# EAGLE design Avionics868 (EAGLE 7.6.0)
COMPANY: ADAFRUIT INDUSTRIES; DRAWN: KTOWN; REV: B

## Sheet 1 of 2
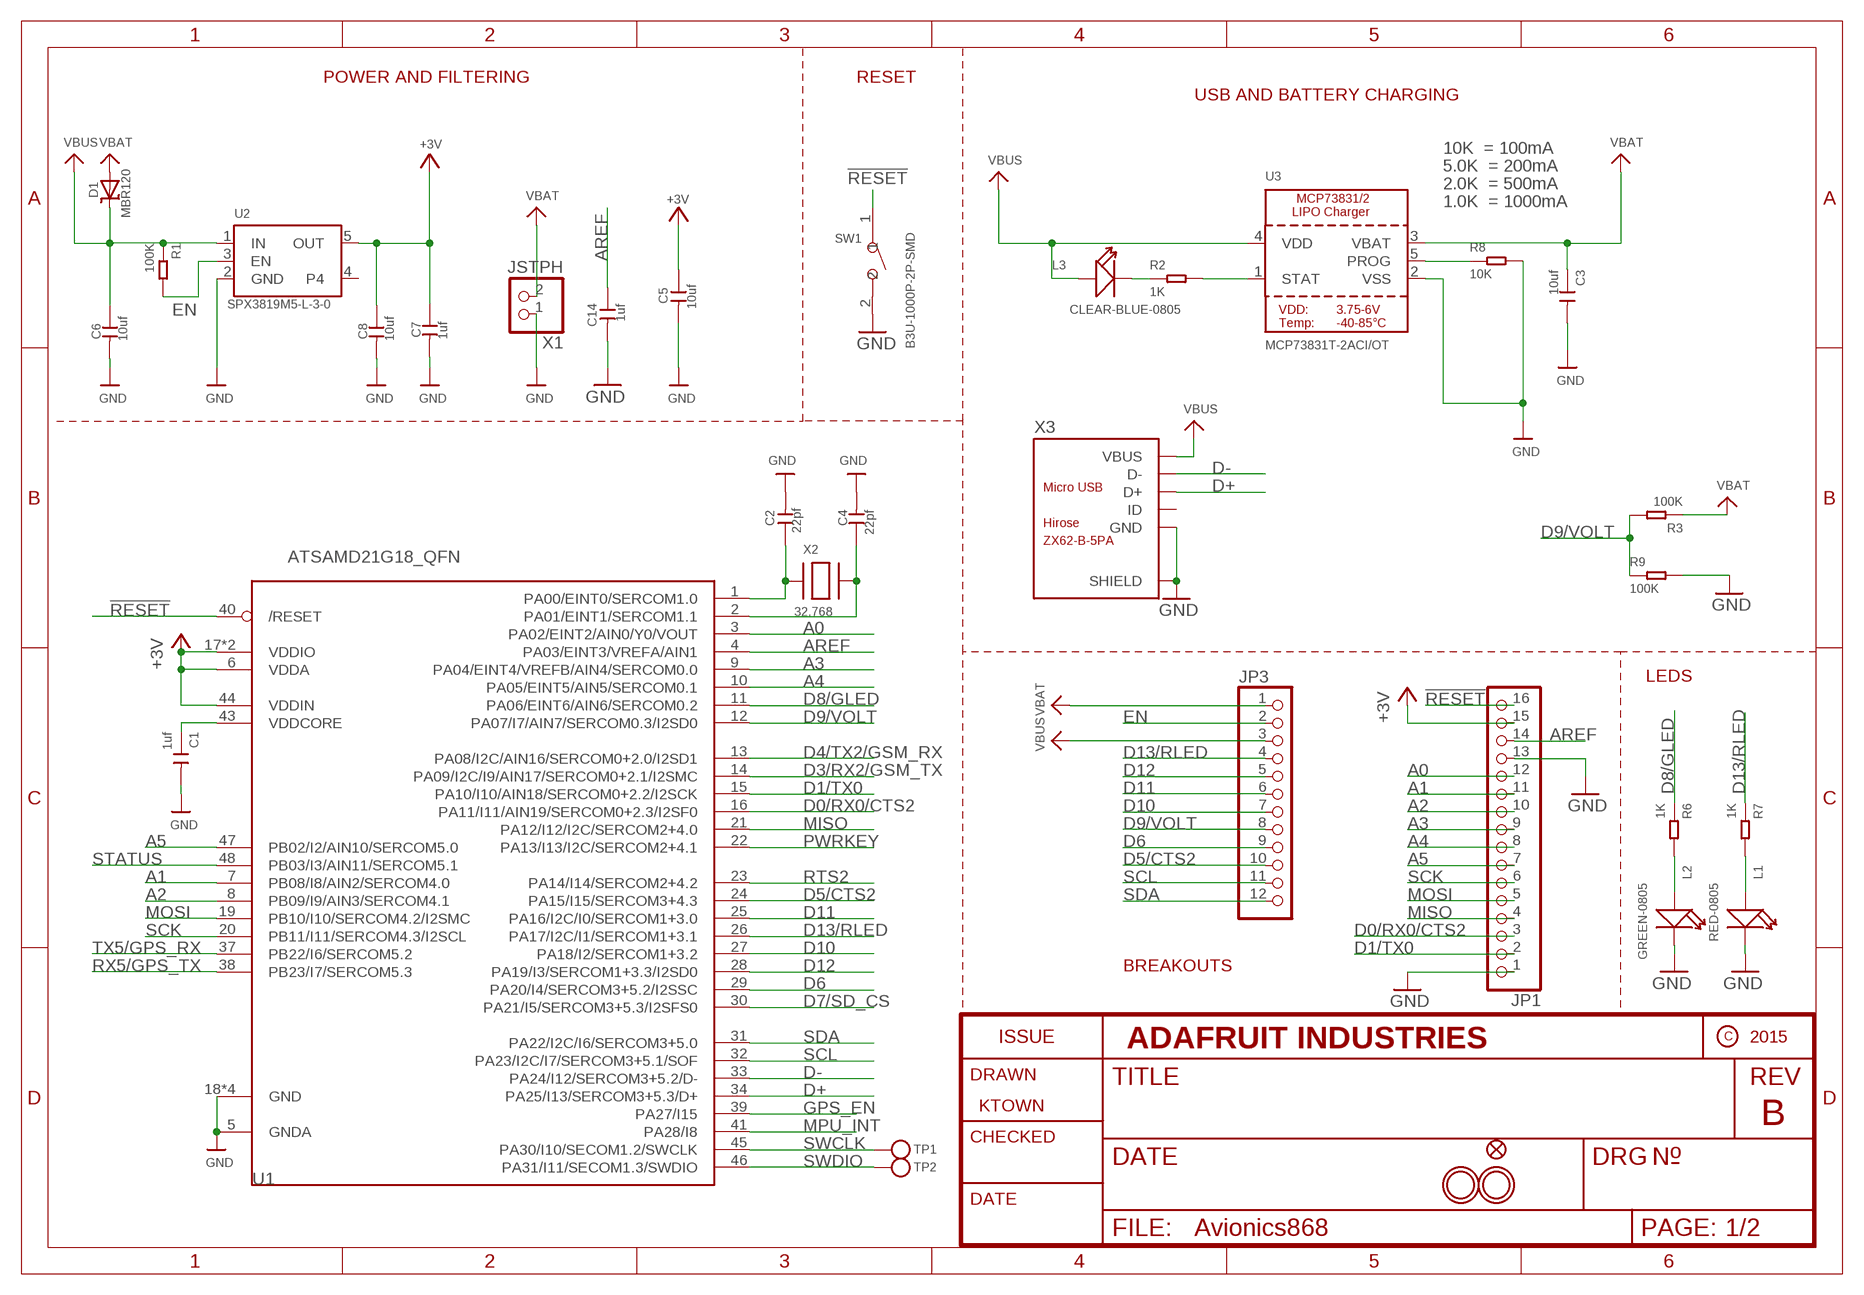
[diagram p0: schematic, sheet 1]

### Parts
C1  1uf  CERAMIC-1UF-25V-10%-X7R(0603)  [C0603]
C2  22pf  CERAMIC-22PF-50V-5%-NPO(0603)  [C0603]
C3  10uf  CERAMIC-10UF-10V-10%-X5R(0603)  [C0603]
C4  22pf  CERAMIC-22PF-50V-5%-NPO(0603)  [C0603]
C5  10uf  CERAMIC-10UF-10V-10%-X5R(0603)  [C0603]
C6  10uf  CERAMIC-10UF-10V-10%-X5R(0603)  [C0603]
C7  1uf  CERAMIC-1UF-25V-10%-X7R(0603)  [C0603]
C8  10uf  CERAMIC-10UF-10V-10%-X5R(0603)  [C0603]
C14  1uf  CERAMIC-1UF-25V-10%-X7R(0603)  [C0603]
D1  MBR120  DIODE-SCHOTTKYSOD-123  [SOD-123]
JP1  HEADER-1X16ROUND  [1X16_ROUND]
JP3  HEADER-1X12  [1X12_ROUND]
L1  RED-0805  SMD-LED-CLEAR-RED(0805)  [LED-0805]
L2  GREEN-0805  SMD-LED-CLEAR-GREEN(0805)  [LED-0805]
L3  CLEAR-BLUE-0805  SMD-LED-CLEAR-BLUE(0805)  [LED-0805]
R1  100K  SMD-RES-100K-5%-1/10W(0603)  [R0603]
R2  1K  SMD-RES-1K-5%-1/10W(0603)  [R0603]
R3  100K  SMD-RES-100K-1%-1/10W(0603)  [R0603]
R6  1K  SMD-RES-1K-5%-1/10W(0603)  [R0603]
R7  1K  SMD-RES-1K-5%-1/10W(0603)  [R0603]
R8  10K  SMD-RES-10K-5%-1/10W(0603)  [R0603]
R9  100K  SMD-RES-100K-1%-1/10W(0603)  [R0603]
SW1  B3U-1000P-2P-SMD  SMD-BUTTON(2P-3.0X2.5X1.2+0.4MM)-B3U-1000P-2P-SMD  [SW2-2.6-3.0X2.5X1.2+0.4MM]
TP1  TESTPOINTROUND1.5MM  [TESTPOINT_ROUND_1.5MM]
TP2  TESTPOINTROUND1.5MM  [TESTPOINT_ROUND_1.5MM]
U1  ATSAMD21G18_QFN  ATSAMD21J_QFN  [TQFN48_7MM]
U2  SPX3819M5-L-3-0  VREG_SOT23-5  [SOT23-5]
U3  MCP73831T-2ACI/OT  MCP73831/2  [SOT23-5]
U$31  MOUNTINGHOLE2.5  [MOUNTINGHOLE_2.5_PLATED]
U$32  MOUNTINGHOLE2.5  [MOUNTINGHOLE_2.5_PLATED]
U$34  FIDUCIAL""  [FIDUCIAL_1MM]
X1  JSTPH  CON_JST_PH_2PIN  [JSTPH2]
X2  32.768  XTAL-3.2X1.5  [XTAL3215]
X3  ZX62-B-5PA  AO1SB141B1-067  [MICRO-USB5+6P-SMD-0.65-AB]

### Nets
!RESET: JP1.16 SW1.1 U1.40(/RESET)
+3V: C5.1 C7.1 C8.1 JP1.15 U1.6(VDDA) U1.17(VDDIO) U1.36(VDDIO) U1.44(VDDIN) U2.5(OUT) ; also sheet 2
A0: JP1.12 U1.3(PA02/EINT2/AIN0/Y0/VOUT)
A1: JP1.11 U1.7(PB08/I8/AIN2/SERCOM4.0)
A2: JP1.10 U1.8(PB09/I9/AIN3/SERCOM4.1)
A3: JP1.9 U1.9(PA04/EINT4/VREFB/AIN4/SERCOM0.0)
A4: JP1.8 U1.10(PA05/EINT5/AIN5/SERCOM0.1)
A5: JP1.7 U1.47(PB02/I2/AIN10/SERCOM5.0)
AREF: C14.1 JP1.14 U1.4(PA03/EINT3/VREFA/AIN1)
D0/RX0/CTS2: JP1.3 U1.16(PA11/I11/AIN19/SERCOM0+2.3/I2SF0)
D1/TX0: JP1.2 U1.15(PA10/I10/AIN18/SERCOM0+2.2/I2SCK)
D3/RX2/GSM_TX: U1.14(PA09/I2C/I9/AIN17/SERCOM0+2.1/I2SMC) ; also sheet 2
D4/TX2/GSM_RX: U1.13(PA08/I2C/AIN16/SERCOM0+2.0/I2SD1) ; also sheet 2
D5/CTS2: JP3.10 U1.24(PA15/I15/SERCOM3+4.3) ; also sheet 2
D6: JP3.9 U1.29(PA20/I4/SERCOM3+5.2/I2SSC)
D7/SD_CS: U1.30(PA21/I5/SERCOM3+5.3/I2SFS0) ; also sheet 2
D8/GLED: R6.1 U1.11(PA06/EINT6/AIN6/SERCOM0.2)
D9/VOLT: JP3.8 R3.2 R9.1 U1.12(PA07/I7/AIN7/SERCOM0.3/I2SD0)
D10: JP3.7 U1.27(PA18/I2/SERCOM1+3.2)
D11: JP3.6 U1.25(PA16/I2C/I0/SERCOM1+3.0)
D12: JP3.5 U1.28(PA19/I3/SERCOM1+3.3/I2SD0)
D13/RLED: JP3.4 R7.1 U1.26(PA17/I2C/I1/SERCOM1+3.1)
D+: U1.34(PA25/I13/SERCOM3+5.3/D+) X3.3(D+)
D-: U1.33(PA24/I12/SERCOM3+5.2/D-) X3.2(D-)
EN: JP3.2 R1.2 U2.3(EN)
GND: C1.2 C2.2 C3.2 C4.2 C5.2 C6.2 C7.2 C8.2 C14.2 JP1.1 JP1.13 L1.- L2.- R8.2 R9.2 SW1.2 U1.5(GNDA) U1.18(GND) U1.35(GND) U1.42(GND) U1.THERMAL(GND) U2.2(GND) U3.2(VSS) X1.1 X3.5(GND) X3.P1(SHIELD) X3.P2(SHIELD) X3.P3(SHIELD) X3.P4(SHIELD) X3.P5(SHIELD) X3.P6(SHIELD) ; also sheet 2
GPS_EN: U1.39(PA27/I15) ; also sheet 2
MISO: JP1.4 U1.21(PA12/I12/I2C/SERCOM2+4.0) ; also sheet 2
MOSI: JP1.5 U1.19(PB10/I10/SERCOM4.2/I2SMC) ; also sheet 2
MPU_INT: U1.41(PA28/I8) ; also sheet 2
N$1: L3.- R2.1
N$2: L2.+ R6.2
N$3: R2.2 U3.1(STAT)
N$4: R8.1 U3.5(PROG)
N$5: C2.1 U1.1(PA00/EINT0/SERCOM1.0) X2.P$1
N$7: C4.1 U1.2(PA01/EINT1/SERCOM1.1) X2.P$2
N$8: L1.+ R7.2
PWRKEY: U1.22(PA13/I13/I2C/SERCOM2+4.1) ; also sheet 2
RTS2: U1.23(PA14/I14/SERCOM2+4.2) ; also sheet 2
RX5/GPS_TX: U1.38(PB23/I7/SERCOM5.3) ; also sheet 2
SCK: JP1.6 U1.20(PB11/I11/SERCOM4.3/I2SCL) ; also sheet 2
SCL: JP3.11 U1.32(PA23/I2C/I7/SERCOM3+5.1/SOF) ; also sheet 2
SDA: JP3.12 U1.31(PA22/I2C/I6/SERCOM3+5.0) ; also sheet 2
STATUS: U1.48(PB03/I3/AIN11/SERCOM5.1) ; also sheet 2
SWCLK: TP1.P$1 U1.45(PA30/I10/SECOM1.2/SWCLK)
SWDIO: TP2.P$1 U1.46(PA31/I11/SECOM1.3/SWDIO)
TX5/GPS_RX: U1.37(PB22/I6/SERCOM5.2) ; also sheet 2
VBAT: C3.1 D1.A JP3.1 R3.1 U3.3(VBAT) X1.2 ; also sheet 2
VBUS: C6.1 D1.C JP3.3 L3.+ R1.1 U2.1(IN) U3.4(VDD) X3.1(VBUS)
VDDCORE: C1.1 U1.43(VDDCORE)
Unconnected: U2.4 X3.4(ID)

### Notes on the sheet
- POWER AND FILTERING | RESET
- USB AND BATTERY CHARGING
- 10K  = 100mA
- 5.0K  = 200mA
- 2.0K  = 500mA
- 1.0K  = 1000mA
- LEDS
- BREAKOUTS

## Sheet 2 of 2
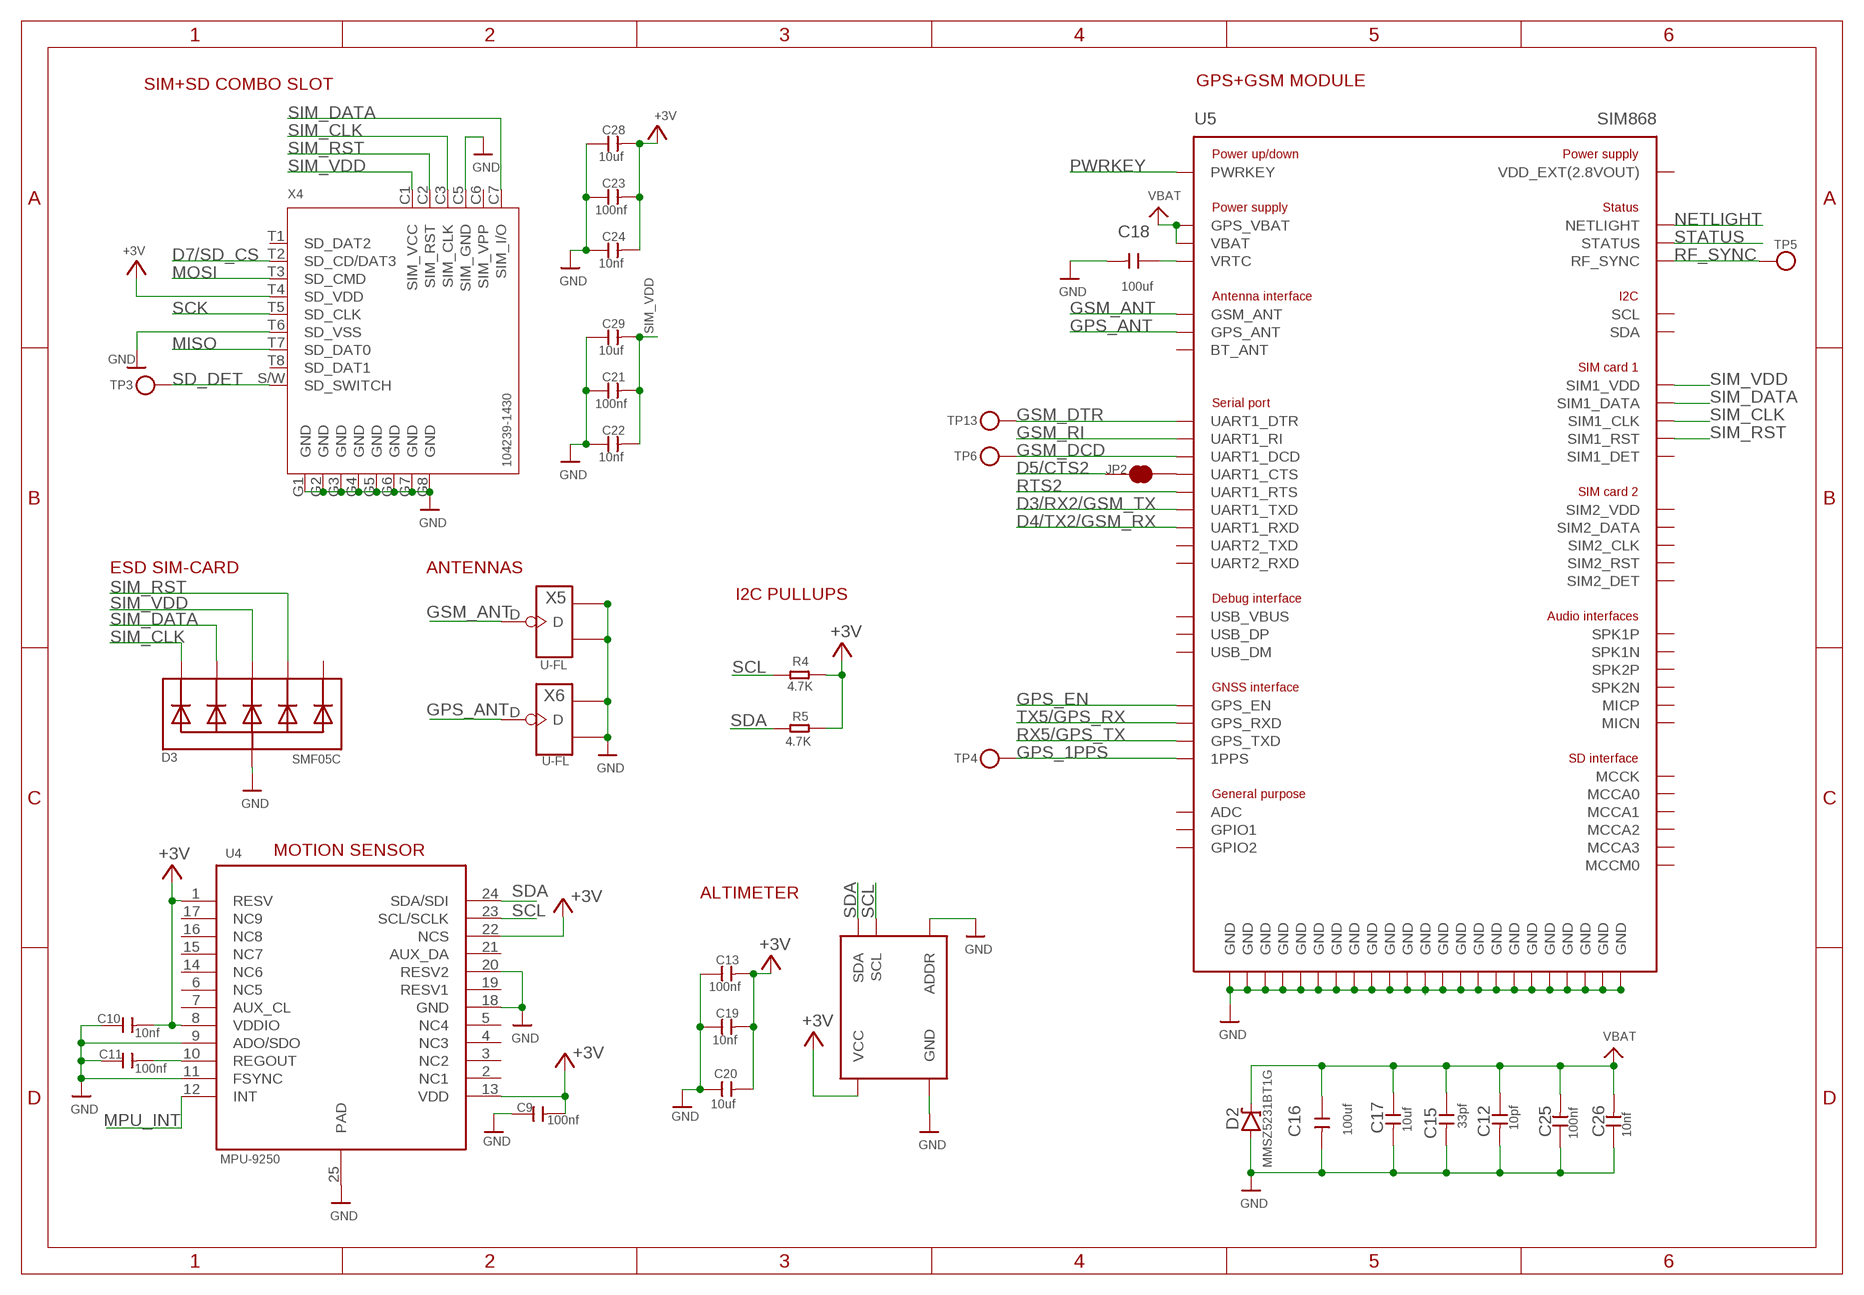
[diagram p1: schematic, sheet 2]

### Parts
C9  100nf  CERAMIC-100NF-50V-10%-X7R(0603)  [C0603]
C10  10nf  CERAMIC-10NF-50V-10%-X7R(0603)  [C0603]
C11  100nf  CERAMIC-100NF-50V-10%-X7R(0603)  [C0603]
C12  10pf  CERAMIC-10PF-50V-5%-NPO(0603)  [C0603]
C13  100nf  CERAMIC-100NF-50V-10%-X7R(0603)  [C0603]
C15  33pf  CERAMIC-33PF-50V-5%-NPO(0603)  [C0603]
C16  100uf  CERAMIC-100UF-6.3V-20%-X5R(1206)  [C1206]
C17  10uf  CERAMIC-10UF-10V-10%-X5R(0603)  [C0603]
C18  100uf  CERAMIC-100UF-6.3V-20%-X5R(1206)  [C1206]
C19  10nf  CERAMIC-10NF-50V-10%-X7R(0603)  [C0603]
C20  10uf  CERAMIC-10UF-10V-10%-X5R(0603)  [C0603]
C21  100nf  CERAMIC-100NF-50V-10%-X7R(0603)  [C0603]
C22  10nf  CERAMIC-10NF-50V-10%-X7R(0603)  [C0603]
C23  100nf  CERAMIC-100NF-50V-10%-X7R(0603)  [C0603]
C24  10nf  CERAMIC-10NF-50V-10%-X7R(0603)  [C0603]
C25  100nf  CERAMIC-100NF-50V-10%-X7R(0603)  [C0603]
C26  10nf  CERAMIC-10NF-50V-10%-X7R(0603)  [C0603]
C28  10uf  CERAMIC-10UF-10V-10%-X5R(0603)  [C0603]
C29  10uf  CERAMIC-10UF-10V-10%-X5R(0603)  [C0603]
D2  MMSZ5231BT1G  [SOD-123]
D3  SMF05C  TVSARRAY_5LANE  [SOT363]
JP2  JUMPER-PAD-2-NC_BY_TRACE  [PAD-JUMPER-2-NC_BY_TRACE_YES_SILK]
R4  4.7K  SMD-RES-4.7K-5%-1/10W(0603)  [R0603]
R5  4.7K  SMD-RES-4.7K-5%-1/10W(0603)  [R0603]
TP3  TESTPOINTROUND1.5MM  [TESTPOINT_ROUND_1.5MM]
TP4  TESTPOINTROUND1.5MM  [TESTPOINT_ROUND_1.5MM]
TP5  TESTPOINTROUND1.5MM  [TESTPOINT_ROUND_1.5MM]
TP6  TESTPOINTROUND1.5MM  [TESTPOINT_ROUND_1.5MM]
TP13  TESTPOINTROUND1.5MM  [TESTPOINT_ROUND_1.5MM]
U4  MPU-9250  [LEAD-QFN24]
U5  SIM868  [SIM868]
U6  BMP280  [LGA-8]
X4  104239-1430  MOLEX-SD+SIM-104239  [MOLEX-SD+SIM-104239]
X5  U-FL  ANTENNA-CONN-U-FL(3P)  [U-FL3P-SMD-2.6X2.6X1.0MM]
X6  U-FL  ANTENNA-CONN-U-FL(3P)  [U-FL3P-SMD-2.6X2.6X1.0MM]

### Nets
+3V: C9.2 C10.2 C13.2 C19.2 C20.2 C23.2 C24.2 C28.2 R4.2 R5.2 U4.1(RESV) U4.8(VDDIO) U4.13(VDD) U4.22(NCS) U6.P2(VCC) U6.P6(VCC) U6.P8(VCC) X4.T4(SD_VDD) ; also sheet 1
D3/RX2/GSM_TX: U5.1_(UART1_TXD) ; also sheet 1
D4/TX2/GSM_RX: U5.2_(UART1_RXD) ; also sheet 1
D5/CTS2: JP2.1 ; also sheet 1
D7/SD_CS: X4.T2(SD_CD/DAT3) ; also sheet 1
GND: C9.1 C10.1 C11.1 C12.2 C13.1 C15.2 C16.2 C17.2 C18.2 C19.1 C20.1 C21.1 C22.1 C23.1 C24.1 C25.1 C26.1 C28.1 C29.1 D2.A D3.2(A) U4.9(ADO/SDO) U4.11(FSYNC) U4.18(GND) U4.20(RESV2) U4.25(PAD) U5.8_(GND) U5.13_(GND) U5.19_(GND) U5.21_(GND) U5.27_(GND) U5.30_(GND) U5.31_(GND) U5.33_(GND) U5.36_(GND) U5.37_(GND) U5.45_(GND) U5.63_(GND) U5.66_(GND) U5.67_(GND) U5.69_(GND) U5.70_(GND) U5.71_(GND) U5.72_(GND) U5.73_(GND) U5.74_(GND) U5.75_(GND) U5.76_(GND) U5.77_(GND) U6.P1(GND) U6.P5(ADDR) U6.P7(GND) X4.C5(SIM_GND) X4.G1(GND) X4.G2(GND) X4.G3(GND) X4.G4(GND) X4.G5(GND) X4.G6(GND) X4.G7(GND) X4.G8(GND) X4.T6(SD_VSS) X5.GND1 X5.GND2 X6.GND1 X6.GND2 ; also sheet 1
GPS_1PPS: TP4.P$1 U5.60_(1PPS)
GPS_ANT: U5.68_(GPS_ANT) X6.D
GPS_EN: U5.59_(GPS_EN) ; also sheet 1
GSM_ANT: U5.32_(GSM_ANT) X5.D
GSM_DCD: TP6.P$1 U5.5_(UART1_DCD)
GSM_DTR: TP13.P$1 U5.6_(UART1_DTR)
GSM_RI: U5.7_(UART1_RI)
MISO: X4.T7(SD_DAT0) ; also sheet 1
MOSI: X4.T3(SD_CMD) ; also sheet 1
MPU_INT: U4.12(INT) ; also sheet 1
N$6: JP2.2 U5.4_(UART1_CTS)
N$23: C11.2 U4.10(REGOUT)
N$29: C18.1 U5.28_(VRTC)
NETLIGHT: U5.41_(NETLIGHT)
PWRKEY: U5.39_(PWRKEY) ; also sheet 1
RF_SYNC: TP5.P$1 U5.29_(RF_SYNC)
RTS2: U5.3_(UART1_RTS) ; also sheet 1
RX5/GPS_TX: U5.61_(GPS_TXD) ; also sheet 1
SCK: X4.T5(SD_CLK) ; also sheet 1
SCL: R4.1 U4.23(SCL/SCLK) U6.P4(SCL) ; also sheet 1
SD_DET: TP3.P$1 X4.S/W(SD_SWITCH)
SDA: R5.1 U4.24(SDA/SDI) U6.P3(SDA) ; also sheet 1
SIM_CLK: D3.1(C1) U5.16_(SIM1_CLK) X4.C3(SIM_CLK)
SIM_DATA: D3.3(C2) U5.15_(SIM1_DATA) X4.C7(SIM_I/O)
SIM_RST: D3.5(C4) U5.17_(SIM1_RST) X4.C2(SIM_RST)
SIM_VDD: C21.2 C22.2 C29.2 D3.4(C3) U5.18_(SIM1_VDD) X4.C1(SIM_VCC)
STATUS: U5.42_(STATUS) ; also sheet 1
TX5/GPS_RX: U5.62_(GPS_RXD) ; also sheet 1
VBAT: C12.1 C15.1 C16.1 C17.1 C25.2 C26.2 D2.C U5.34_(GPS_VBAT) U5.35_(VBAT) ; also sheet 1
Unconnected: D3.6(C5) U4.2(NC1) U4.3(NC2) U4.4(NC3) U4.5(NC4) U4.6(NC5) U4.7(AUX_CL) U4.14(NC6) U4.15(NC7) U4.16(NC8) U4.17(NC9) U4.19(RESV1) U4.21(AUX_DA) U5.9_(MICP) U5.10_(MICN) U5.11_(SPK1P) U5.12_(SPK1N) U5.14_(SIM1_DET) U5.20_(BT_ANT) U5.22_(UART2_TXD) U5.23_(UART2_RXD) U5.25_(USB_DP) U5.26_(USB_DM) U5.38_(ADC) U5.43_(SPK2N) U5.44_(SPK2P) U5.46_(MCCA3) U5.47_(MCCA2) U5.48_(MCCA1) U5.49_(MCCA0) U5.50_(MCCK) U5.51_(MCCM0) U5.52_(SIM2_DET) U5.53_(SIM2_DATA) U5.54_(SIM2_CLK) U5.55_(SIM2_RST) U5.57_(GPIO1) U5.58_(GPIO2) U5.64_(SDA) U5.65_(SCL) X4.C6(SIM_VPP) X4.T1(SD_DAT2) X4.T8(SD_DAT1)

### Notes on the sheet
- SIM+SD COMBO SLOT | GPS+GSM MODULE
- ESD SIM-CARD | ANTENNAS
- I2C PULLUPS
- MOTION SENSOR
- ALTIMETER

## Power pins joined to a net without a drawn wire
SIM2_VDD: U5.56_(SIM2_VDD)
USB_VBUS: U5.24_(USB_VBUS)
VDD_EXT(2.8VOUT): U5.40_(VDD_EXT(2.8VOUT))

## Library data of the parts
C1 C7 C14 = Seeed-Capacitor-2016:CERAMIC-1UF-25V-10%-X7R(0603): 302010139; MPN: CC0603KRX7R8BB105
C2 C4 = Seeed-Capacitor-2016:CERAMIC-22PF-50V-5%-NPO(0603): 302010143; MPN: CC0603JRNPO9BN220
C3 C5 C6 C8 C17 C20 C28 C29 = Seeed-Capacitor-2016:CERAMIC-10UF-10V-10%-X5R(0603): 302010103; MPN: CC0603KRX5R6BB106
C9 C11 C13 C21 C23 C25 = Seeed-Capacitor-2016:CERAMIC-100NF-50V-10%-X7R(0603): 302010138; MPN: CC0603KRX7R9BB104
C10 C19 C22 C24 C26 = Seeed-Capacitor-2016:CERAMIC-10NF-50V-10%-X7R(0603): 302010140; MPN: CC0603KRX7R9BB103
C12 = Seeed-Capacitor-2016:CERAMIC-10PF-50V-5%-NPO(0603): 302010097; MPN: CC0603JRNPO9BN100
C15 = Custom:CERAMIC-33PF-50V-5%-NPO(0603): not in Seeed OPL; MPN: CC0603JRNPO9BN330
C16 C18 = Seeed-Capacitor-2016:CERAMIC-100UF-6.3V-20%-X5R(1206): 302010183; MPN: GRM31CR60J107ME39L
D1 = microbuilder:DIODE-SCHOTTKY
D2 = Deegou-Diodes:MMSZ5231BT1G: DIODE ZENER 5.1V 500MW SOD123; MFR: ON SEMICONDUCTOR; MPN: MMSZ5231BT1G
D3 = microbuilder:TVSARRAY_5LANE: Voltage Transient Suppressor Array SOT363 SMF05C - 100W 5V: Digikey - SMF05CT1GOSCT-ND
JP1 = microbuilder:HEADER-1X16: PIN HEADER
JP2 = SparkFun-Passives:JUMPER-PAD-2-NC_BY_TRACE
JP3 = microbuilder:HEADER-1X12
L1 = Seeed-LED-2016:SMD-LED-CLEAR-RED(0805): 304090046; MPN: 17-215SURC/S530-A2/TR8
L2 = Seeed-LED-2016:SMD-LED-CLEAR-GREEN(0805): 304090057; MPN: 17-215SYGC/S530-E2/TR8
L3 = Seeed-LED-2016:SMD-LED-CLEAR-BLUE(0805): 304090061; MPN: EL-17-215/BHC-AN1P2/3T
R1 = Seeed-Resistor-2016:SMD-RES-100K-5%-1/10W(0603): 301010089; MPN: RC0603JR-07100KL; VALUE: 100K 1/10W
R2 R6 R7 = Seeed-Resistor-2016:SMD-RES-1K-5%-1/10W(0603): 301010291; MPN: RC0603JR-071KL; VALUE: 1K 1/10W
R3 R9 = Seeed-Resistor-2016:SMD-RES-100K-1%-1/10W(0603): 301010196; MPN: RC0603FR-07100KL
R4 R5 = Seeed-Resistor-2016:SMD-RES-4.7K-5%-1/10W(0603): 301010290; MPN: RC0603JR-074K7L
R8 = Seeed-Resistor-2016:SMD-RES-10K-5%-1/10W(0603): 301010293; MPN: RC0603JR-0710KL; VALUE: 10K 1/10W
SW1 = Seeed-Switch-2016:SMD-BUTTON(2P-3.0X2.5X1.2+0.4MM): 311020047; MPN: B3U-1000P-2P-SMD
TP1-TP6 TP13 = microbuilder:TESTPOINT: Test Point Various test points for characterisation and PCB testing TESTPOINT_SMT - Compact Surface Mount Test Point [Digikey: 5016KTR-ND]
U1 = microbuilder:ATSAMD21J
U2 = microbuilder:VREG_SOT23-5: SOT23-5 Fixed Voltage Regulators Part Current Out V Out V In V Dropout θJA (°C/W) TJ (°C) Digikey Part No. ADP121 150mA 3.3V 3.4-5.5V 0.09V @ 150mA -- -- ADP121-AUJZ33R7CT-ND ADP121 150mA 3.0V 3.1-5.5V 0.09V @ 150mA -- -- ADP121-AUJZ30R7CT-ND ADP122 300mA 3.3V 3.4-5.5V 0.085V @ 300mA -- -- ADP122AUJZ-3.3-R7CT-ND ADP1712 300mA 3.3V 3.5-5.5V 0.17V @ 300mA -- -- ADP1712AUJZ-3.3-R7TR-ND AP7311 (Low Cost) 150mA 3.3V 3.5-6V 0.15V @ 150mA -- -- AP7311-33WG-7DICT-ND LD39015M18R 150mA 1.8V 1.9V-5.5V 0.08V @ 100mA -- -- 497-6977-1-ND LP2985A-33DBVR 150mA 3.3V 3.3-16V 0.28V @ 150mA 206 150 296-18479-1-ND MCP1824T-3302E/OT 300mA 3.3V 3.5V-6V 0.2V @ 300mA -- -- MCP1824T-3302E/OTCT-ND MIC5205-2.5YM5 TR 150mA 2.5V 2.7-16V 0.165V @ 150mA -- -- 576-1257-2-ND MIC5205-3.0YM5 TR 150mA 3.0V 3.2V-16V 0.165V @ 150mA -- -- 576-1258-2-ND MIC5205-3.3YM5 TR 150mA 3.3V 3.5V-16V 0.165V @ 150mA -- -- 576-1259-2-ND TPS780330220 150mA 3.3V+2.2V 3.6-5.5V 250mV Max -- -- 296-23332-1-ND TDA3663/N1,135 100mA 3.3V 3.5-45V 0.18V @ 50mA -- -- 568-5343-1-ND Max operating temp can be calculated using θJA, TJ (max junction temperature), and power in watts. Set the "Maximum Ambient Temperature" until it reaches TJ ("Max Junction Temperature"), which is the absolute limit for safe use of the regulator: Heat Sink Temperature Calculator <http://www.daycounter.com/Calculators/Heat-Sink-Temperature-Calculator.phtml> For example, With 12V source into a 3.3V LP2985 and a 30mA load, we are dissipating (12V-3.3V) * 0.03A = 0.261W. With a θJA of 206 °C/W, a TJ of 150°C, and 261mW we can safely use the chip without a heat sink up to 75°C (=147.1°C Junction Temperature).
U3 = microbuilder:MCP73831/2: MCP73831/2 LIPO Charger VDD: 3.75 - 6V Temp -40 - 85°C Programmable Charge Rate: 15-500mA NOTE: STAT is a tri-state logic output on the MCP73831 and an open-drain output on the MCP73832. SOT23-5 with 4.2V output and tri-state logic on STAT = MCP73831T-2ACI/OT
U4 = misc:MPU-9250
U5 = SIM868:SIM868
U6 = BMP280:BMP280: A 100nF capacitor is recommended between Vdd and GND, and also between Vddio and GND. Vdd & Vddio 3.3v I2C Address: ADDR -> Vddio = 0x77, ADDR -> GND = 0x76
U$31 U$32 = microbuilder:MOUNTINGHOLE: Mounting Hole For #2 screws (0.086"/2.18mm width, 0.094"/2.4mm hole) use 2.5mm; BOM: EXCLUDE
U$34 = microbuilder:FIDUCIAL: Fiducial Alignment Points Various fiducial points for machine vision alignment.; BOM: EXCLUDE
X1 = microbuilder:CON_JST_PH_2PIN: JST 2-Pin Right-Angle Connector PH-Series - 4UConnector: 17311 SH-Series - 4UConnector: 07278
X2 = adafruit2:XTAL: Low cost SMT crystals, no capacitors included http://www.ladyada.net/library/eagle
X3 = Deegou-Connectors:AO1SB141B1-067: MICR USB B SMD TH SHLL CONN RCPT; MFR: Generic; MPN: AO1SB141B1-067; SEEED: ZX62-B-5PA
X4 = SimSdCombo:MOLEX-SD+SIM-104239: microSD/Nano-SIM Combo Connector Molex - 1042391430 Description: microSD/Nano-SIM Combo Connector 2.05mm Height, Pull-Lever Eject, Normal Mount, With Detect Switch, 8-Circuit microSD* Card Type, 6-Circuit Nano-SIM Card Type; MPN: VSHO-21-3301; VALUE: VSHO-21-3301
X5 X6 = Seeed-Connector -2016:ANTENNA-CONN-U-FL(3P): 320110048

## Board
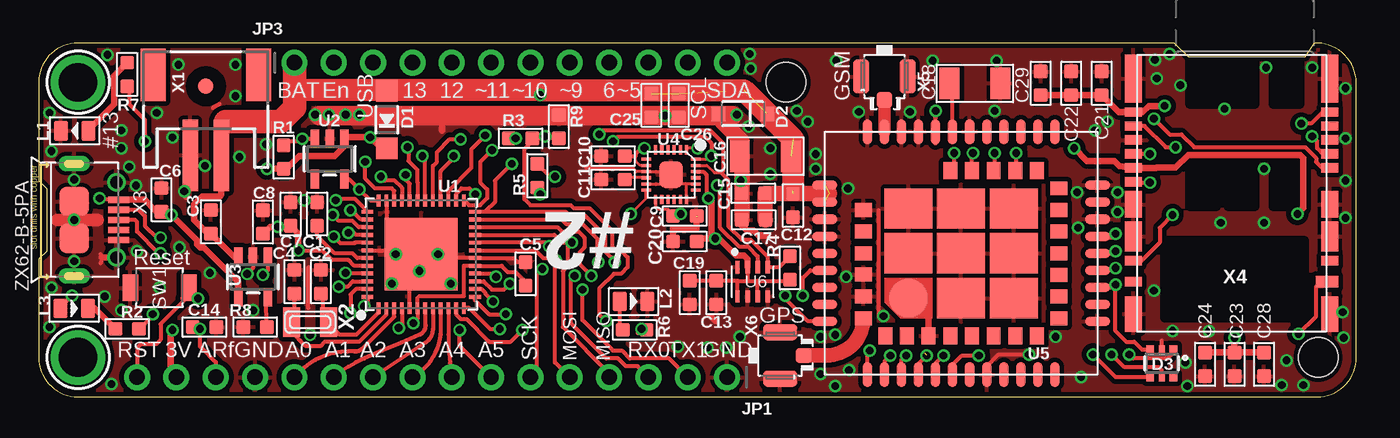
[diagram p2: board, top side]
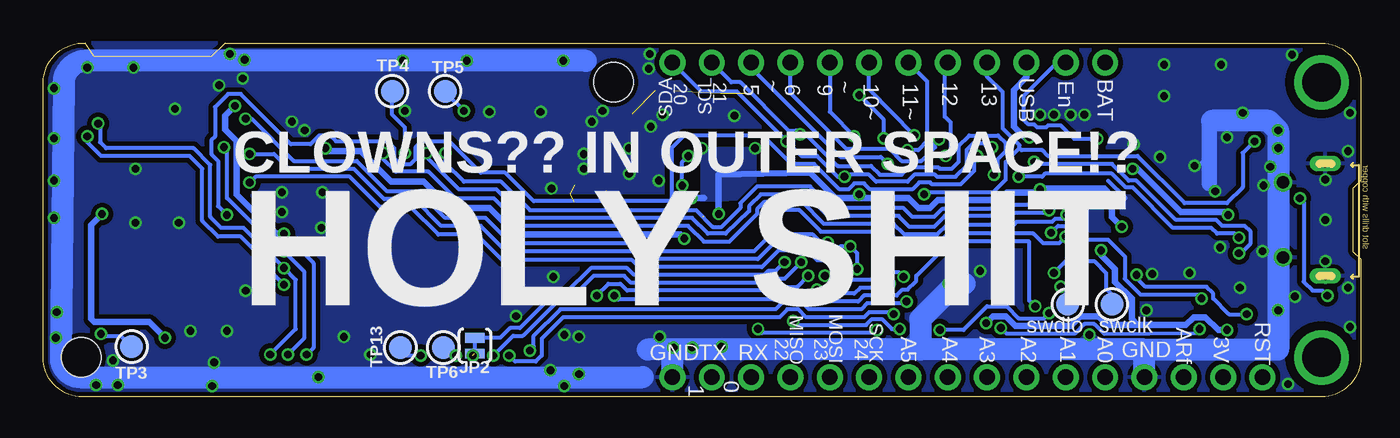
[diagram p3: board, bottom side, seen from below]

Size 85.09 x 22.86 mm. Coordinates in mm from the lower left corner, seen from the top.
Outline: 2.54,0 82.55,0 arc90 85.09,2.54 85.09,20.32 arc90 82.36,22.86 81.79,21.97 74.23,21.97 73.34,22.86 2.54,22.86 arc90 0,20.32 0,13.97 0.51,13.46 0.51,9.4 0,8.89 0,2.54 arc90 2.54,0
Copper layers (1*16): Top 0.035mm / dielectric 1.5mm / Bottom 0.035mm
Design rules "MacroFab_MF_Standard_2_Layer": minimum track width 5mil, minimum drill 12mil, track to track 5mil, track to pad 5mil, pad to pad 5mil, via to via 5mil, smd to smd 0mil, copper to edge 10mil, drill to drill 10mil, minimum pad ring 6mil, minimum via ring 6mil, stop-mask expansion 2mil, vias tented up to drill 25mil, thermal gap 10mil
Holes 2.54 mm at 48.26,20.32 82.61,2.54

### Footprints (pad centres in the part's own frame; a part is rotated, then mirrored left to right if it is on the bottom)
C0603 = smd 0.889 x 0.889: 1 0,0.762; 2 0,-0.762
C1206 = smd 1.27 x 2.032: 1 -1.651,0; 2 1.651,0
SOD-123 = smd 1.4 x 1.4: A 1.85,0; C -1.85,0
SOD-123' = smd 0.9 x 0.95: A 1.575,0; C -1.575,0
SOT363 = smd 0.5 x 0.5: 1 -0.75,-0.9; 3 0.75,-0.9; 4 0.75,0.9; 6 -0.75,0.9 | smd 0.4 x 0.5: 2 0,-0.9; 5 0,0.9
1X16_ROUND = drill 1 pad 1.676: 1 -19.05,0; 2 -16.51,0; 3 -13.97,0; 4 -11.43,0; 5 -8.89,0; 6 -6.35,0; 7 -3.81,0; 8 -1.27,0; 9 1.27,0; 10 3.81,0; 11 6.35,0; 12 8.89,0; 13 11.43,0; 14 13.97,0; 15 16.51,0; 16 19.05,0
PAD-JUMPER-2-NC_BY_TRACE_YES_SILK = smd 0.635 x 1.27: 1 -0.508,0; 2 0.508,0
1X12_ROUND = drill 1 pad 1.676: 1 -13.97,0; 2 -11.43,0; 3 -8.89,0; 4 -6.35,0; 5 -3.81,0; 6 -1.27,0; 7 1.27,0; 8 3.81,0; 9 6.35,0; 10 8.89,0; 11 11.43,0; 12 13.97,0
LED-0805 = smd 0.889 x 1.27: + -0.889,0; - 0.889,0
R0603 = smd 0.889 x 0.889: 1 0,0.762; 2 0,-0.762
SW2-2.6-3.0X2.5X1.2+0.4MM = smd 1 x 1.7: 1 -1.9,0; 2 1.9,0
TESTPOINT_ROUND_1.5MM = smd 1.5 x 1.5: P$1 0,0
TQFN48_7MM = smd 0.25 x 0.75: 1 -2.75,-3.475; 2 -2.25,-3.475; 3 -1.75,-3.475; 4 -1.25,-3.475; 5 -0.75,-3.475; 6 -0.25,-3.475; 7 0.25,-3.475; 8 0.75,-3.475; 9 1.25,-3.475; 10 1.75,-3.475; 11 2.25,-3.475; 12 2.75,-3.475; 25 2.75,3.475; 26 2.25,3.475; 27 1.75,3.475; 28 1.25,3.475; 29 0.75,3.475; 30 0.25,3.475; 31 -0.25,3.475; 32 -0.75,3.475; 33 -1.25,3.475; 34 -1.75,3.475; 35 -2.25,3.475; 36 -2.75,3.475 | smd 0.75 x 0.25: 13 3.475,-2.75; 14 3.475,-2.25; 15 3.475,-1.75; 16 3.475,-1.25; 17 3.475,-0.75; 18 3.475,-0.25; 19 3.475,0.25; 20 3.475,0.75; 21 3.475,1.25; 22 3.475,1.75; 23 3.475,2.25; 24 3.475,2.75; 37 -3.475,2.75; 38 -3.475,2.25; 39 -3.475,1.75; 40 -3.475,1.25; 41 -3.475,0.75; 42 -3.475,0.25; 43 -3.475,-0.25; 44 -3.475,-0.75; 45 -3.475,-1.25; 46 -3.475,-1.75; 47 -3.475,-2.25; 48 -3.475,-2.75 | smd 4.7 x 4.7: THERMAL 0,0
SOT23-5 = smd 0.55 x 1.2: 1 -0.95,-1.3; 2 0,-1.3; 3 0.95,-1.3; 4 0.95,1.3; 5 -0.95,1.3
LEAD-QFN24 = smd 0.6 x 0.2: 1 -1.6,1; 2 -1.6,0.6; 3 -1.6,0.2; 4 -1.6,-0.2; 5 -1.6,-0.6; 6 -1.6,-1; 13 1.6,-1; 14 1.6,-0.6; 15 1.6,-0.2; 16 1.6,0.2; 17 1.6,0.6; 18 1.6,1 | smd 0.2 x 0.6: 7 -1,-1.6; 8 -0.6,-1.6; 9 -0.2,-1.6; 10 0.2,-1.6; 11 0.6,-1.6; 12 1,-1.6; 19 1,1.6; 20 0.6,1.6; 21 0.2,1.6; 22 -0.2,1.6; 23 -0.6,1.6; 24 -1,1.6 | smd 1.7 x 1.54: 25 0,0
SIM868 = smd 1.6 x 0.6: 1_ -7.85,6.05; 2_ -7.85,4.95; 3_ -7.85,3.85; 4_ -7.85,2.75; 5_ -7.85,1.65; 6_ -7.85,0.55; 7_ -7.85,-0.55; 8_ -7.85,-1.65; 9_ -7.85,-2.75; 10_ -7.85,-3.85; 11_ -7.85,-4.95; 12_ -7.85,-6.05; 22_ 7.85,-6.05; 23_ 7.85,-4.95; 24_ 7.85,-3.85; 25_ 7.85,-2.75; 26_ 7.85,-1.65; 27_ 7.85,-0.55; 28_ 7.85,0.55; 29_ 7.85,1.65; 30_ 7.85,2.75; 31_ 7.85,3.85; 32_ 7.85,4.95; 33_ 7.85,6.05 | smd 0.6 x 1.6: 13_ -4.4,-8.8; 14_ -3.3,-8.8; 15_ -2.2,-8.8; 16_ -1.1,-8.8; 17_ 0,-8.8; 18_ 1.1,-8.8; 19_ 2.2,-8.8; 20_ 3.3,-8.8; 21_ 4.4,-8.8; 34_ 4.4,8.8; 35_ 3.3,8.8; 36_ 2.2,8.8; 37_ 1.1,8.8; 38_ 0,8.8; 39_ -1.1,8.8; 40_ -2.2,8.8; 41_ -3.3,8.8; 42_ -4.4,8.8 | smd 1.1 x 0.9: 43_ -5.35,4.9; 44_ -5.35,3.5; 45_ -5.35,2.1; 46_ -5.35,0.7; 47_ -5.35,-0.7; 48_ -5.35,-2.1; 49_ -5.35,-3.5; 50_ -5.35,-4.9; 58_ 5.35,-4.9; 59_ 5.35,-3.5; 60_ 5.35,-2.1; 61_ 5.35,-0.7; 62_ 5.35,0.7 | smd 0.9 x 1.1: 51_ -4.2,-6.3; 52_ -2.8,-6.3; 53_ -1.4,-6.3; 54_ 0,-6.3; 55_ 1.4,-6.3; 56_ 2.8,-6.3; 57_ 4.2,-6.3; 63_ 2.8,6.3; 64_ 1.4,6.3; 65_ 0,6.3; 66_ -1.38,6.3; 67_ -2.8,6.3; 68_ -4.2,6.3 | smd 2.5 x 2.5: 69_ -2.9,3.4 | smd 2.6 x 3.1: 70_ -2.9,0; 71_ -2.9,-3.4; 72_ 0,-3.4; 73_ 2.9,-3.4; 74_ 2.9,0; 75_ 2.9,3.4; 76_ 0,3.4; 77_ 0,0
LGA-8 = smd 0.8 x 0.35: P1 0.95,0.975; P2 0.95,0.325; P3 0.95,-0.325; P4 0.95,-0.975; P5 -0.95,-0.975; P6 -0.95,-0.325; P7 -0.95,0.325; P8 -0.95,0.975
MOUNTINGHOLE_2.5_PLATED = drill 2.5 pad 3.2: P$1 0,0
FIDUCIAL_1MM = smd 1 x 1: 1 0,0
JSTPH2 = smd 1 x 4.6: 1 -1,-3.7; 2 1,-3.7 | smd 1.6 x 3.4: NC1 -3.4,1.5; NC2 3.4,1.5
XTAL3215 = smd 1.1 x 1.9: P$1 1.2,0; P$2 -1.2,0
MICRO-USB5+6P-SMD-0.65-AB = smd 0.4 x 1.35: 1 -1.3,2.875; 2 -0.65,2.875; 3 0,2.875; 4 0.65,2.875; 5 1.3,2.875 | smd 1.9 x 1.9: P1 -1.2,0; P2 1.2,0 | drill 0.508 pad 1.016 long: P3 -3.625,0; P4 3.625,0 | drill 0.8: P5 -2.425,2.73; P6 2.425,2.73
MOLEX-SD+SIM-104239 = smd 1.1 x 0.6: C1 6.35,-5.25; C2 6.35,-4.35; C3 -6.35,-5.25; C5 6.35,-3.45; C6 -6.35,-4.35; C7 -6.35,-2.55; T1 6.35,5.715; T2 6.35,4.36; T3 6.35,-0.75; T4 6.35,-1.65; T5 6.35,-2.55; T6 -6.35,-3.45; T7 -6.35,-1.65; T8 -6.35,4.36 | smd 1.1 x 3.1: G1 -6.35,-7.4; G8 6.35,-7.4 | smd 1.1 x 1.72: G2 -6.35,0.71; G7 6.35,0.71 | smd 1.1 x 1.94: G3 -6.35,2.79; G6 6.35,2.79 | smd 1.1 x 2.3: G4 -6.35,7.8; G5 6.35,7.8 | smd 1.45 x 0.75: S/W -6.175,5.715
U-FL3P-SMD-2.6X2.6X1.0MM = smd 1.05 x 1: D -1.524,0 | smd 2.2 x 1.05: GND1 0,1.5; GND2 0,-1.5

### Placement (x,y rotation side)
C1  17.98,11.81 180 top
C2  18.22,7.43 180 top
C3  11.11,11.3 180 top
C4  16.51,7.43 180 top
C5  31.43,7.94 180 top
C6  7.93,12.72 180 top
C7  16.27,11.81 180 top
C8  14.48,11.29 180 top
C9  41.72,11.68 270 top
C10  37.08,15.56 90 top
C11  37.08,14.03 90 top
C12  48.7,12.36 0 top
C13  43.75,6.73 180 top
C14  10.7,4.5 90 top
C15  46.14,13.14 270 top
C16  46.93,15.54 180 top
C17  46.16,11.43 270 top
C18  60.45,20.26 0 top
C19  42.04,6.73 180 top
C20  41.72,10.03 90 top
C21  68.64,20.26 0 top
C22  66.67,20.26 0 top
C23  77.22,2.1 180 top
C24  75.31,2.1 180 top
C25  39.56,18.83 180 top
C26  41.34,18.83 180 top
C28  79.12,2.1 180 top
C29  64.71,20.26 0 top
D1  22.48,17.91 90 top
D2  MMSZ5231BT1G  [SOD-123']  45.47,18.29 180 top
D3  72.52,2.16 180 top
JP1  25.4,1.27 180 top
JP2  57.21,3.3 270 bottom
JP3  30.48,21.59 0 top
L1  2.33,17.19 180 top
L2  38.42,6.16 0 top
L3  2.29,5.71 0 top
R1  15.81,15.49 180 top
R2  5.71,4.38 90 top
R3  31.11,16.7 90 top
R4  48.51,8.32 0 top
R5  32.19,14.29 0 top
R6  38.48,4.32 270 top
R7  5.71,20.83 180 top
R8  13.97,4.51 270 top
R9  33.59,17.46 180 top
SW1  7.81,7.05 180 top
TP1  16.07,5.97 0 bottom
TP2  18.92,5.97 0 bottom
TP3  79.38,3.24 180 bottom
TP4  62.55,19.75 0 bottom
TP5  59.12,19.75 0 bottom
TP6  59.25,3.17 0 bottom
TP13  62.01,3.17 0 bottom
U1  24.7,9.21 0 top
U2  18.8,15.37 180 top
U3  13.84,7.75 180 top
U4  40.83,14.35 270 top
U5  59.56,9.27 90 top
U6  46.1,7.43 90 top
U$31  2.54,20.32 270 top
U$32  2.54,2.54 270 top
U$34  10.79,20.07 270 top
X1  10.79,19.3 0 top
X2  17.53,4.83 0 top
X3  2.29,11.43 270 top
X4  77.03,13.14 180 top
X5  54.61,20.7 90 top
X6  47.88,2.67 180 top

### Tracks (layer width: path | path; a pad name or v marks a point on that pad's centre or on a via)
!RESET  (via drill 0.5)
  Top 0.254: JP1.16 6.35,3.17 6.6,3.43 7.62,3.43 7.87,3.68 7.87,4.7 9.52,6.34 v10.28,6.34 v10.29,6.35 9.27,6.35 SW1.1 | U1.40 20.49,10.46 20.34,10.6 v20,10.6
  Bottom 0.254: v20,10.6 19.56,11.05 18.61,11.05 17.72,10.16 16.32,10.16 15.24,9.08 15.24,7.62 14.22,6.6 10.54,6.6 v10.29,6.35
+3V  (via drill 0.5)
  Top 0.203: U4.8 38.83,14.95 38.54,15.24 38.54,15.56 | v42.55,16.07 41.88,16.07 U4.1 | U4.13 39.83,12.3 40.01,12.13 40.64,12.13 C9.2
  Top 0.254: v24.19,4.76 24.45,5.02 U1.6 24.45,6.37 24.57,6.49 27.45,6.49 27.45,8.46 U1.17 29.9,8.46 30.29,8.06 30.8,8.06 31.5,7.37 C5.1 | v16.76,9.46 18.31,9.46 18.94,8.83 20,8.83 20.37,8.46 U1.44 | U1.36 21.42,12.68 v20.7,13.4 20.03,14.07 U2.5 | U4.22 42.92,14.55 43.12,14.35 43.12,12.83 v43.24,12.83 | R5.2 32.38,13.53 v32.38,13.08 | C10.2 38.54,15.56 38.54,15.68 38.92,16.07 v39.12,16.07 | U6.P6 46.43,7.49 | 45.13,7.49 C13.2 C19.2 | R4.2 48.32,7.68 48.13,7.49 46.43,7.49 | U6.P8 45.13,7.49 | 45.13,7.49 45.78,7.49 | 45.78,7.49 46.43,7.49 | U6.P2 45.78,7.49 | C9.2 v41.47,11.81
  Top 0.406: C7.1 16.38,10.99 16.38,10.92 16.76,10.54 v16.76,9.46 | C7.1 16.29,11.01 | JP1.15 8.51,1.65 8.51,4.19 v8.64,4.32 | C7.1 16.2,10.99 v15.43,10.99 14.94,10.99 C8.1 | v66.86,16.07 67.69,15.24 69.47,15.24 69.79,14.92 X4.T4 72.14,14.79 72.2,14.8 73.41,14.8 74.23,15.62 81.47,15.62 81.66,15.43 81.66,12.19 v81.28,11.81 | C24.2 C23.2 | C23.2 C28.2 | U6.P2 45.78,8.9 45.53,9.14 45.02,9.14 43.94,10.22 v43.69,10.22 | v43.69,10.22 43.43,10.48 43.43,12.64 v43.24,12.83 | v43.69,10.22 42.67,10.22 C20.2 | v77.22,3.81 C23.2
  Bottom 0.406: v16.76,9.46 16.76,9.14 15.88,8.26 15.88,7.43 14.8,6.35 14.8,5.02 14.41,4.64 | 8.76,4.45 v8.64,4.32 9.21,4.32 10.03,5.14 10.79,5.14 11.3,4.64 14.41,4.64 | v15.43,10.99 16.07,11.62 16.07,12.95 16.57,13.46 20.64,13.46 v20.7,13.4 20.89,13.21 22.86,13.21 23.37,12.7 27.3,12.7 27.81,12.19 28.57,12.19 29.21,12.83 32.45,12.83 | v24.19,4.76 23.75,5.21 22.92,5.21 22.29,4.57 18.73,4.57 18.1,5.21 16.95,5.21 16.38,4.64 14.41,4.64 | 32.45,12.83 33.91,12.83 35.56,14.48 41.47,14.35 v41.47,11.81 | v32.38,13.08 32.45,12.83 | v43.69,10.22 43.94,10.48 54.55,10.48 56.26,12.19 58.8,12.19 60.52,13.91 62.61,13.91 64.58,15.88 66.67,15.88 v66.86,16.07 | v43.24,12.83 42.42,12.83 | v81.28,11.81 81.98,11.11 81.98,5.02 81.79,4.83 78.23,4.83 v77.22,3.81
  pour Bottom: 42.55,12.64 42.55,16.07 39.12,16.07 39.12,12.76
A0
  Top 0.254: U1.3 22.95,5.17 20.89,3.11 arc-49 20.38,2.92 arc54 JP1.12
A1
  Top 0.254: U1.7 24.95,4.76 arc-81 24.57,4 arc0 21.02,2.48 arc16 JP1.11
A2
  Top 0.254: U1.8 25.45,4.37 arc-59 24.96,3.49 JP1.10
A3
  Top 0.254: U1.9 25.95,4.36 arc-61 JP1.9
A4
  Top 0.254: U1.10 26.45,4.03 arc9 JP1.8
A5  (via drill 0.5)
  Top 0.254: U1.47 20.48,6.96 20.13,6.6 v20.13,5.4 | JP1.7 27.18,3.3 v27.18,4.32
  Bottom 0.254: v27.18,4.32 25.65,4.32 24.13,5.84 22.86,5.84 22.1,5.08 20.45,5.08 v20.13,5.4
AREF  (via drill 0.5)
  Top 0.254: U1.4 23.45,4.66 v23.24,4.45 | C14.1 10.06,4.38 v10.41,4.38 10.41,3.25 11.43,2.23 JP1.14
  Bottom 0.254: v10.41,4.38 10.67,4.13 16.57,4.06 17.21,4.7 17.84,4.7 18.48,4.06 22.86,4.06 v23.24,4.45
D0/RX0/CTS2  (via drill 0.5)
  Top 0.254: U1.16 29.32,7.96 v29.53,7.75 | JP1.3 38.67,1.97 37.91,1.97 37.4,2.48 36.64,2.48 34.35,4.76 34.35,7.56 v34.61,7.81
  Bottom 0.254: v29.53,7.75 29.84,8.06 30.8,8.06 31.3,7.56 34.35,7.56 v34.61,7.81
D1/TX0  (via drill 0.5)
  Top 0.254: v35.12,6.92 35.12,4.95 37.08,2.98 37.66,2.98 38.16,2.48 40.7,2.48 JP1.2 | U1.15 28.74,7.46 29.27,6.92 30.04,6.92 v30.42,7.3
  Bottom 0.254: v35.12,6.92 34.86,6.67 32.7,6.67 32.32,7.05 30.67,7.05 v30.42,7.3
D3/RX2/GSM_TX  (via drill 0.5)
  Top 0.254: U5.1_ 53.51,2.71 v53.66,2.98 | U1.14 28.6,6.96 28.83,6.73 28.83,6.67 v29.34,6.16
  Bottom 0.254: v53.66,2.98 53.4,3.24 53.4,3.94 51.69,5.65 37.78,5.65 37.34,6.1 36.07,6.1 35.62,5.65 32.26,5.65 31.88,6.03 29.46,6.03 v29.34,6.16
D4/TX2/GSM_RX  (via drill 0.5)
  Top 0.254: v54.99,2.67 54.61,2.29 U5.2_ | U1.13 28.18,6.24 29.08,5.33 v30.16,5.33
  Bottom 0.254: v30.16,5.33 30.29,5.46 31.75,5.46 32.07,5.14 35.81,5.14 36.32,5.65 37.02,5.65 37.53,5.14 51.5,5.14 52.9,3.75 52.9,2.67 53.28,2.29 54.61,2.29 v54.99,2.67
D5/CTS2  (via drill 0.5)
  Top 0.254: U1.24 28.83,11.96 | 28.83,11.96 34.02,11.96 34.29,11.68 35.31,11.68 36.58,10.41 36.58,9.4 37.21,8.76 v37.21,8.7 | v30.54,15.05 29.46,13.97 29.46,12.59 28.83,11.96
  Bottom 0.254: v30.54,15.05 30.99,15.49 33.59,15.49 39.37,21.27 JP3.10 | v37.21,8.7 37.78,8.13 38.29,8.13 38.54,7.87 46.93,7.87 47.37,8.32 49.72,8.32 51.37,6.67 52.07,6.67 54.29,4.45 54.93,4.45 55.56,3.81 JP2.1
D6  (via drill 0.5)
  Top 0.254: U1.29 25.45,14.91 25.72,15.18 25.72,15.81 26.54,16.64 v27.24,16.64
  Bottom 0.254: JP3.9 36.83,19.62 33.21,16 30.42,16 29.65,15.24 28.38,15.24 27.5,16.13 27.5,16.38 v27.24,16.64
D7/SD_CS  (via drill 0.5)
  Top 0.254: U1.30 24.95,15.36 v24.77,15.55 v24.77,15.56 | v73.22,11.75 72.39,10.92 72.39,9.97 71.2,8.78 X4.T2
  Bottom 0.254: v24.77,15.56 24.96,15.37 24.96,14.61 25.84,13.72 27.69,13.72 27.81,13.84 28.51,13.84 28.96,13.4 31.69,13.4 32.07,13.78 32.7,13.78 33.08,13.4 33.66,13.4 35.31,15.05 36.77,15.05 38.61,16.89 43.69,16.89 44.51,16.07 44.51,12.76 44.64,12.64 53.4,12.64 55.24,14.48 56.83,14.48 58.86,16.51 60.64,16.51 61.02,16.13 61.02,15.37 61.34,15.05 62.04,15.05 62.42,15.43 62.42,16.07 62.87,16.51 66.17,16.51 66.55,16.89 67.25,16.89 67.82,16.32 69.09,16.32 72.33,19.56 73.15,19.56 73.98,18.73 73.98,16.83 74.23,16.57 74.23,15.68 73.79,15.24 73.79,12.32 v73.22,11.75
D8/GLED  (via drill 0.5)
  Top 0.254: U1.11 26.95,5.31 27.24,5.02 27.62,5.02 29.08,3.56 30.48,3.56 v31.24,4.32 | R6.1 39.43,4.13 38.67,4.13 v38.92,4.38
  Bottom 0.254: v31.24,4.32 31.43,4.13 38.67,4.13 v38.92,4.38
D9/VOLT  (via drill 0.5)
  Top 0.254: 27.45,5.7 U1.12 27.8,5.73 29.15,4.38 v29.78,4.38 | R9.1 32.83,16.7 v32.7,16.83 32.58,16.7 R3.2 31.88,16.51 31.37,16 31.37,12.76 31.75,12.38 34.35,12.38 34.54,12.19 35.56,12.19 37.02,10.73 37.02,9.72 37.27,9.46 37.59,9.46 38.04,9.02 38.04,8.38 37.59,7.94 37.15,7.94 36.2,6.99 36.2,5.33 v36.64,4.89
  Bottom 0.254: v36.64,4.89 36.39,4.64 31.94,4.64 31.56,5.02 30.92,5.02 30.29,4.38 v29.78,4.38 | JP3.8 34.29,18.41 v32.7,16.83
D10  (via drill 0.5)
  Top 0.254: U1.27 26.45,13.31 27.94,14.8 27.94,16 v28.83,16.89
  Bottom 0.254: v28.83,16.89 31.75,19.88 JP3.7
D11  (via drill 0.5)
  Top 0.254: U1.25 27.47,12.7 27.79,12.38 28.51,12.38 28.96,12.83 28.96,13.4 28.51,13.84 28.51,15.18 v29.27,15.94
  Bottom 0.254: JP3.6 28,20.38 28,16.51 28.57,15.94 v29.27,15.94
D12  (via drill 0.5)
  Top 0.254: U1.28 25.95,14.59 26.8,15.43 v26.8,15.56
  Bottom 0.254: v26.8,15.56 26.48,15.88 26.48,17.72 26.86,18.1 26.86,21.4 JP3.5
D13/RLED  (via drill 0.5)
  Top 0.254: R7.1 5.84,19.72 5.84,18.92 6.86,17.91 v6.86,16.51 | U1.26 26.95,13.11 27.3,13.46 27.81,13.46 v28.19,13.08
  Bottom 0.254: 22.04,16.07 22.92,15.18 22.92,14.03 23.75,13.21 28.07,13.21 v28.19,13.08 | 22.04,16.07 22.04,16.26 23.11,17.34 23.11,19.68 24.13,20.7 JP3.4 | 22.04,16.07 21.91,15.94 20.57,15.94 20.19,15.56 14.41,15.56 11.37,12.51 8.64,12.51 7.62,13.53 7.62,15.75 v6.86,16.51
D+  (via drill 0.5)
  Top 0.254: v7.87,9.27 7.75,9.27 6.35,10.67 6.35,11.3 6.22,11.43 X3.3 | U1.34 22.95,13.31 22.8,13.46 21.72,13.46 21.08,14.1 v21.08,15.18
  Bottom 0.254: v7.87,9.27 7.75,9.27 7.11,9.91 7.11,10.67 7.49,11.05 8.95,11.05 9.34,11.43 11.94,11.43 14.48,13.97 14.99,13.97 16.07,15.05 20.95,15.05 v21.08,15.18
D-  (via drill 0.5)
  Top 0.254: v7.87,10.29 7.62,10.29 6.86,11.05 6.86,11.68 6.46,12.08 X3.2 | U1.33 23.45,13.51 22.99,13.97 22.35,13.97 v22.1,14.22
  Bottom 0.254: v7.87,10.29 8.13,10.54 9.27,10.54 9.65,10.92 12.13,10.92 14.73,13.53 15.18,13.53 16.07,14.41 20.38,14.41 20.57,14.22 v22.1,14.22
EN  (via drill 0.5)
  Top 0.254: 17.85,16.7 U2.3 v17.02,16.67 16.86,16.67 16.7,16.51 16.04,16.51 R1.2
  Bottom 0.254: JP3.2 19.62,21.59 21.78,19.43 21.78,17.91 21.46,17.59 21.08,17.59 20.89,17.4 20.32,17.4 20.19,17.53 19.37,17.53 18.51,16.67 v17.02,16.67
GND  (via drill 0.5)  (1 unrouted)
  Top 0.203: 38.35,14.8 38.6,14.55 U4.9 40.83,14.55 U4.25 40.83,13.75 | U4.20 41.83,13.75 | U4.18 41.83,13.75 | 41.83,13.75 40.83,13.75 | U4.11 40.83,13.75
  Top 0.254: U1.35 22.45,11.46 v24.57,8.13 | 24.45,9.46 v24.57,8.13 | U1.5 23.95,7.19 23.74,7.19 v22.8,7.3 | v24.57,8.13 24.95,8.96 U1.18 30.67,8.96 30.92,8.7 C5.2 | U1.42 21.27,9.46 22.35,9.46 arc-34 v23.05,9.21 | 17.4,5.71 17.4,8.38 | 11.68,18.92 11.24,18.67 | 54.23,12.06 54.23,5.21 | D3.2 72.52,3.62 | 38.35,14.8 35.37,14.8 | U3.2 13.84,8.32 v13.46,7.94 | 4,9.21 4.06,9.02 4,8.64 | U5.8_ 61.21,1.97 61.98,2.73 v63.94,2.73
  Top 0.406: 26.04,18.48 26.04,17.21 | U5.45_ 57.46,6.37 U5.69_ | 9.53,12.95 9.53,13.65 9.78,13.91 9.78,13.97 | 5.02,9.02 4.06,9.02 | 43.37,5.21 43.69,4.89 | 45.4,11.49 45.4,11.05 45.72,10.73 46.16,10.73 46.48,10.41 47.05,10.41 | 40.96,10.29 40.96,10.86 42.48,10.86 42.48,11.62
  Top 0.813: 1.21,11.43 v2.29,11.43 3.81,11.43
  Top 1.016: C17.2 45.4,11.49 45.4,16.51 43.75,18.16
  Top 1.27: 44.77,18.16 v40.45,18.16 18.1,18.16
  Bottom 0.254: 15.24,12.76 15.18,12.83 16.32,13.97 | v10.73,14.92 10.48,14.92 10.16,15.24
  Bottom 1.016: 9.78,13.78 9.78,17.65 9.59,17.84
  Bottom 1.422: JP1.13 13.97,3.05 | 13.97,3.05 28.45,3.05 | 28.45,3.05 44.45,3.05 | JP1.1 44.45,3.05 | 13.97,3.05 5.46,3.05 | 44.45,3.05 46.04,3.05 | 5.4,3.05 5.33,3.05 v5.33,17.21 5.97,17.84 9.59,17.84 | 50.04,21.72 82.3,21.72 arc-90 83.76,20.26 83.95,2.54 arc-90 82.68,1.27 46.35,1.27 | 25.59,7.3 26.16,7.3 28.45,5.02 28.45,3.05
  other vias: 7.62,18.35 13.84,5.59 11.05,8 8.64,16.76 12.95,15.49 17.84,18.22 17.14,12.7 9.02,21.46 12.7,19.43 12.7,21.46 14.67,16.32 54.55,5.21 50.48,3.87 0.7,4.51 4.7,0.83 0.7,18.35 4.45,22.1 57.72,21.72 17.53,4 5.33,5.59 7.81,7.05 5.33,16.07 0.83,15.88 4.25,6.48 9.4,13.27 25.78,9.21 61.72,18.48 5.84,14.86 26.61,7.3 61.85,21.72 72.07,21.78 80.58,2.35 65.66,3.87 67.31,1.27 52.13,7.75 6.35,9.4 0.83,7.05 45.97,21.21 45.91,22.16 52.26,13.46 51.5,21.72 52.96,18.41 56.26,18.41 50.48,1.46 52.32,1.71 45.28,3.87 45.34,13.97 47.24,14.41 41.27,3.24 43.18,3.17 44.39,3.17 51.44,4 18.73,18.22 19.81,18.22 20.7,18.22 9.08,9.65 2.29,14.03 2.29,8.76 6.29,13.65 45.09,18.22 47.24,16.07 48.96,18.48 49.66,17.78 50.16,15.68 50.16,14.73 45.85,17.46 72.2,20.57 69.02,17.78 68.2,17.21 69.66,13.21 67.06,13.21 67.12,10.92 74.04,2.22 73.22,4.25 72.01,6.86 75.56,4.25 69.66,11.94 84.39,16.7 84.39,13.97 84.39,11.56 84.2,5.46 84.26,3.81 74.17,0.7 84.39,19.94 80.26,0.76 81.66,0.76 51.44,0.7 73.03,22.16 73.72,20.13 79.25,21.27 76.58,18.61 82.23,21.27 79.12,11.24 76.33,11.24 79.12,14.73
  pour Top (isolate 0.305, rank 6): 0,22.86 0,0 85.22,0 85.22,22.86
  pour Bottom (isolate 0.305, rank 6): 85.22,0 0,0 0,22.86 85.22,22.86
GPS_1PPS  (via drill 0.5)
  Top 0.254: v61.72,15.75 61.72,14.68 U5.60_
  Bottom 0.254: 61.72,15.73 v61.72,15.75 61.72,17.4 62.55,18.22 TP4.P$1
GPS_ANT
  Top 0.94: X6.D 50.86,2.67 arc90 U5.68_
GPS_EN  (via drill 0.5)
  Top 0.254: U5.59_ 63.12,14.68 v63.12,15.75 | v18.99,11.75 19.37,11.37 20.26,11.37 20.67,10.96 U1.39
  Bottom 0.254: v18.99,11.75 19.24,11.49 19.75,11.49 19.94,11.3 22.23,11.3 22.42,11.11 26.73,11.11 27.37,10.48 29.46,10.48 30.16,11.18 34.67,11.18 36.07,12.57 38.54,12.57 38.99,12.13 38.99,11.81 40.77,10.03 42.42,10.03 43.43,11.05 54.23,11.05 56.01,12.83 58.48,12.83 60.2,14.54 62.29,14.54 63.12,15.37 v63.12,15.75
GSM_ANT
  Top 0.813: U5.32_ arc-90 U5.32_ X5.D
GSM_DCD  (via drill 0.5)
  Top 0.254: U5.5_ 57.91,2.16 v58.42,2.67
  Bottom 0.254: TP6.P$1 59.12,2.67 v58.42,2.67
GSM_DTR  (via drill 0.5)
  Top 0.254: U5.6_ 59.01,2.05 59.63,2.67 v60.71,2.67
  Bottom 0.254: TP13.P$1 61.89,2.67 v60.71,2.67
MISO  (via drill 0.5)
  Top 0.254: JP1.4 36.83,1.52 33.85,4.51 33.85,8.13 34.16,8.45 34.16,9.78 v34.42,9.97 33.78,9.97 33.29,10.46 U1.21 | v72.01,17.97 73.03,16.95 73.79,16.95 74.61,16.13 81.79,16.13 82.49,15.43 82.49,15.18 82.87,14.79 X4.T7 83.06,14.79
  Bottom 0.254: v72.01,17.97 71.63,17.97 68.9,15.24 64.83,15.24 62.87,13.27 60.83,13.27 59.12,11.56 56.52,11.56 54.86,9.91 46.55,9.91 46.04,9.4 39.18,9.4 38.1,10.48 35.37,10.48 34.86,9.97 v34.42,9.97
MOSI  (via drill 0.5)
  Top 0.254: JP1.5 33.34,2.22 33.34,8.76 v33.4,8.83 33.27,8.95 32.58,8.95 32.07,9.46 U1.19 | X4.T3 70.75,13.83 v71.75,13.84
  Bottom 0.254: v33.4,8.83 35.12,8.83 35.75,9.46 37.59,9.46 38.67,8.38 46.61,8.38 47.05,8.83 55.44,8.83 57.09,10.48 59.56,10.48 61.34,12.26 63.31,12.26 65.28,14.22 71.37,14.22 v71.75,13.84
MPU_INT  (via drill 0.5)
  Top 0.203: v38.23,11.81 39.23,12.81 U4.12 39.43,13.35
  Top 0.254: v19.05,10.35 19.49,9.91 20.38,9.91 arc-90 20.43,9.96 U1.41
  Bottom 0.254: v19.05,10.35 19.49,9.91 20.51,9.91 21.14,10.54 26.67,10.54 27.24,9.97 29.78,9.97 30.48,10.67 34.86,10.67 36.26,12.06 37.97,12.06 v38.23,11.81
N$1
  Top 0.406: L3.- 3.62,5.71 R2.1
N$2
  Top 0.254: R6.2 37.53,4.51 L2.+
N$3  (via drill 0.5)
  Top 0.254: U3.1 14.79,8.19 v14.48,7.87 | 6.57,4.45 R2.2 6.6,4.47 7.37,5.23 v7.37,5.33
  Bottom 0.254: v7.37,5.33 8.51,5.33 9.53,6.35 9.53,6.67 9.97,7.11 13.91,7.11 14.48,7.68 v14.48,7.87
N$4
  Top 0.254: R8.1 14.69,6.35 U3.5
N$5
  Top 0.254: U1.1 21.95,5.44 20.51,4 19.42,4 18.98,4.45 X2.P$1 19.05,4.9 19.05,5.59 18.48,5.59 18.35,5.71 18.35,6.54 C2.1
N$6  (via drill 0.5)  (1 unrouted)
  Top 0.254: U5.4_ 56.81,2.14 v57.34,2.67
N$7
  Top 0.254: U1.2 22.45,5.31 20.7,3.56 18.48,3.56 18.22,3.3 17.21,3.3 16.89,3.63 16.58,3.94 X2.P$2 16.51,5.01 C4.1
N$8
  Top 0.406: L1.+ 3.21,17.25 4.89,18.92 4.89,20.77 R7.2
N$23
  Top 0.203: U4.10 37.96,14.15 C11.2
N$29
  Top 0.254: U5.28_ 59.01,19.71 58.8,19.94 C18.1
PWRKEY  (via drill 0.5)
  Top 0.254: v49.34,6.54 49.34,7.68 49.83,8.17 U5.39_ | v35.69,7.81 34.92,8.57 34.92,9.34 35.24,9.65 35.24,10.29 34.86,10.67 33.78,10.67 33.49,10.96 U1.22
  Bottom 0.254: v49.34,6.54 48.58,7.3 47.82,7.3 47.37,6.86 38.1,6.86 37.85,7.11 36.39,7.11 v35.69,7.81
RF_SYNC  (via drill 0.5)
  Top 0.254: U5.29_ 57.91,18.03 v57.91,18.48
  Top 0.406: U5.29_ 57.91,16.45
  Bottom 0.254: TP5.P$1 59.12,19.68 v57.91,18.48
RTS2  (via drill 0.5)
  Top 0.254: U5.3_ 55.71,2.37 v56.01,2.67 | U1.23 33.76,11.46 34.04,11.18 35.12,11.18 36.07,10.22 36.07,8.76 v36.13,8.7
  Bottom 0.254: v56.01,2.67 54.74,3.94 54.1,3.94 51.88,6.16 51.18,6.16 49.53,7.81 47.56,7.81 47.12,7.37 38.35,7.37 38.1,7.62 37.21,7.62 v36.13,8.7
RX5/GPS_TX  (via drill 0.5)
  Top 0.254: U5.61_ 60.26,15.68 v60.33,15.75 | U1.38 20.8,11.46 20.19,12.06 v20.13,12.06
  Bottom 0.254: v60.33,15.75 60.33,15.49 58.23,13.4 55.82,13.4 53.98,11.56 43.18,11.56 42.16,10.54 41.02,10.54 39.5,12 39.5,12.32 38.73,13.08 35.81,13.08 34.42,11.68 29.84,11.68 29.15,10.99 27.56,10.99 26.86,11.68 22.61,11.68 22.42,11.87 20.38,11.87 20.19,12.06 v20.13,12.06
SCK  (via drill 0.5)
  Top 0.254: U1.20 32.72,9.96 v32.96,9.72 | JP1.6 32.19,1.71 32.19,7.94 v32.51,8.26 | v71.75,15.68 71.12,15.68 | 71.12,15.68 71.06,15.81 | X4.T5 71.12,15.68
  Bottom 0.254: v32.51,8.26 32.51,9.27 v32.96,9.72 33.59,9.72 34.04,9.27 34.86,9.27 35.56,9.97 37.85,9.97 38.92,8.89 46.29,8.89 46.8,9.4 55.18,9.4 56.83,11.05 59.37,11.05 61.09,12.76 63.06,12.76 65.02,14.73 69.22,14.73 70.17,15.68 v71.75,15.68
SCL  (via drill 0.5)
  Top 0.203: U4.23 43.15,14.95 43.62,14.48 44.07,14.48
  Top 0.254: U1.32 23.95,13.77 23.69,14.03 v23.69,14.35 | v36.2,16.95 36.45,17.21 43.37,17.21 44.2,16.38 44.2,14.61 44.07,14.48 44.51,14.03 44.51,11.05 45.4,10.16 45.97,10.16 47.05,9.08 47.05,8.53 U6.P4 47.82,8.38 R4.1
  Bottom 0.254: v23.69,14.35 23.43,14.61 23.43,15.37 22.92,15.88 22.92,16.38 23.43,16.89 25.27,16.89 25.97,16.19 25.97,15.18 26.42,14.73 27.18,14.73 27.24,14.8 29.21,14.8 29.65,14.35 31.05,14.35 31.62,14.92 33.78,14.92 35.81,16.95 v36.2,16.95 36.45,17.21 36.96,17.21 40.07,20.32 40.64,20.32 JP3.11
SD_DET  (via drill 0.5)
  Top 0.254: v81.34,4.06 82.49,5.21 82.49,7.11 82.55,7.18 82.95,7.18 X4.S/W
  Bottom 0.254: v81.34,4.06 81.22,3.94 80.07,3.94 TP3.P$1
SDA  (via drill 0.5)
  Top 0.203: U4.24 43.16,15.35 43.56,15.75
  Top 0.254: U1.31 24.45,13.85 24.45,13.91 24.45,14.67 23.88,15.24 23.88,16.07 v23.81,16.13 | v37.08,16.51 37.34,16.76 43.05,16.76 43.43,16.38 v43.43,15.56 43.56,15.75 | v33.34,14.22 33.02,14.22 R5.1 | v43.81,13.65 44.01,13.46 44.01,10.92 45.21,9.72 45.78,9.72 46.42,9.08 46.42,8.51 U6.P3
  Bottom 0.254: JP3.12 42.61,19.75 40.32,19.75 v37.08,16.51 36.13,15.56 35.12,15.56 33.78,14.22 v33.34,14.22 33.21,14.35 31.75,14.35 31.3,13.91 29.27,13.91 28.83,14.35 27.5,14.35 27.37,14.22 26.16,14.22 25.46,14.92 25.46,15.94 25.02,16.38 24.38,16.38 24.13,16.13 v23.81,16.13 | v43.81,13.65 43.81,15.18 v43.43,15.56
SIM_CLK  (via drill 0.5)
  Top 0.254: v69.53,8.32 69.39,8.17 U5.16_ | D3.1 73.15,2.94 73.15,2.73 72.9,2.48 70.67,2.48 v70.42,2.73 | X4.C3 82.91,18.39 82.17,17.65 v81.53,17.65
  Bottom 0.254: v70.42,2.73 68.77,4.38 68.77,7.56 v69.53,8.32 72.14,10.92 73.6,10.92 74.3,11.62 74.3,14.99 75.37,16.07 81.03,16.07 81.41,16.45 81.41,17.53 v81.53,17.65
SIM_DATA  (via drill 0.5)
  Top 0.254: D3.3 71.76,3.05 71.25,3.05 70.74,3.56 70.23,3.56 69.53,4.25 v69.53,7.24 69.36,7.07 U5.15_ | X4.C7 82.92,15.69 82.55,16.07 82.55,16.51 v82.23,16.83
  Bottom 0.254: v69.53,7.24 70.29,8 70.29,8.32 72.33,10.35 73.79,10.35 74.8,11.37 74.8,14.73 75.63,15.56 81.34,15.56 82.23,16.45 v82.23,16.83
SIM_RST  (via drill 0.5)
  Top 0.254: U5.17_ 69.34,9.27 v69.53,9.4 | X4.C2 71.41,17.49 72.77,16.13 v73.41,16.13 | D3.5 72.52,1.71 72.33,1.91 70.1,1.91 v69.28,2.73
  Bottom 0.254: v73.41,16.13 73.22,15.94 73.22,12.83 69.79,9.4 v69.53,9.4 68.2,8.06 68.2,3.81 v69.28,2.73
SIM_VDD  (via drill 0.5)
  Top 0.254: D3.4 69.54,1.26 v68.07,2.73
  Top 0.406: U5.18_ 69.3,10.37 v69.53,10.54 | C29.2 C22.2 C21.2 69.74,18.39 X4.C1 71.27,18.39 71.67,18.8 v72.71,18.8
  Bottom 0.254: v69.53,10.54 67.63,8.64 67.63,3.17 v68.07,2.73
  Bottom 0.406: v72.71,18.8 73.34,18.16 73.34,17.27 72.58,16.51 72.58,13.08 70.04,10.54 v69.53,10.54
STATUS  (via drill 0.5)
  Top 0.254: U1.48 21.23,6.05 v21.02,5.84 | U5.42_ 49.67,4.87 48.2,6.35 v48.2,6.54
  Bottom 0.254: v48.2,6.54 47.94,6.29 37.91,6.29 37.59,6.6 35.88,6.6 35.43,6.16 32.45,6.16 32.07,6.54 29.97,6.54 29.59,6.92 29.27,6.92 28.7,7.49 28.7,7.81 26.48,10.03 21.4,10.03 21.4,6.22 v21.02,5.84
SWCLK  (via drill 0.5)
  Top 0.254: U1.45 19.86,7.96 v19.81,8
  Bottom 0.254: TP1.P$1 16.07,6.6 16.45,6.99 16.45,8 17.21,8.76 19.05,8.76 v19.81,8
SWDIO  (via drill 0.5)
  Top 0.254: U1.46 20.29,7.46 19.94,7.11 v19.37,7.11
  Bottom 0.254: TP2.P$1 18.92,6.67 v19.37,7.11
TX5/GPS_RX  (via drill 0.5)
  Top 0.254: U5.62_ 59.12,14.86 v59.12,15.75 | v19.18,12.7 19.24,12.76 20.45,12.76 21.23,11.98 U1.37
  Bottom 0.254: v19.18,12.7 19.24,12.76 20.45,12.76 20.83,12.38 22.73,12.38 22.99,12.13 27.05,12.13 27.56,11.62 28.96,11.62 29.53,12.19 34.16,12.19 35.56,13.59 38.99,13.59 40.07,12.51 40.07,12.19 41.27,10.99 41.85,10.99 42.93,12.06 53.66,12.06 55.5,13.91 57.91,13.91 59.12,15.11 v59.12,15.75
VBAT  (via drill 0.5)  (7 unrouted)
  Top 0.254: 12.06,17.78 11.79,17.51 X1.2 | v32.38,19.49 32.38,19.81 | R3.1 v30.8,16.7 | 44.39,19.75 44.45,19.81
  Top 0.406: X1.2 11.79,13.06 11.68,12.95 10.54,12.95 10.03,12.45 10.03,11.43 10.92,10.54 C3.1 12.61,9.05 U3.3 | D1.A 22.48,20.32 16.51,20.32
  Top 1.016: 46.9,13.12 C12.1 51.05,13.12 | 46.9,13.12 C15.1 | 46.9,13.12 46.9,11.46 C17.1
  Top 1.422: 16.51,19.81 32.38,19.81 44.45,19.81 45.53,19.81 48.7,16.64 48.7,13.34
  Top 1.524: JP3.1 16.51,20.32 16.51,19.81 16.51,18.67 15.62,17.78 12.06,17.78
  Bottom 0.254: v30.8,16.7 30.8,17.91 v32.38,19.49
VBUS  (via drill 0.5)
  Top 0.254: 7.55,12.01 C6.1 | v2.16,6.54 1.4,5.78 L3.+ | X3.1 4.03,12.73 v3.94,12.83
  Top 0.406: U2.1 19.75,16.19 19.11,15.56 16.83,15.56 15.98,14.71 R1.1 v14.73,14.73 | U3.4 12.89,7.43 10.67,9.65 10.41,9.65 10.22,9.84 10.22,10.1 v8.57,11.75 8.35,11.75 C6.1 | 7.55,12.01 6.83,12.73 X3.1 | U2.1 19.75,16.76 | D1.C 22.04,16.12 v21.4,16.76 19.84,16.76 U2.1
  Bottom 0.254: v2.16,6.54 2.48,6.86 3.11,6.86 3.68,7.43 3.68,12.57 v3.94,12.83
  Bottom 0.406: 14.8,14.73 v14.73,14.73 14.41,14.73 11.62,11.94 8.76,11.94 v8.57,11.75 | JP3.3 21.59,20.64 22.42,19.81 22.42,17.46 21.72,16.76 v21.4,16.76
VDDCORE
  Top 0.254: U1.43 20.57,8.96 20.26,9.27 19.12,9.27 17.98,10.4 C1.1

### Text on the board
tPlace: GSM | BAT | En | 13 | 12 | ~ | 11 | ~ | 10 | ~ | 9 | 6 | ~5 | SDA | USB | SCL | #13 | #2 | Reset | GPS | SCK | MOSI | MISO | RST | 3V | ARf | GND | A0 | A1 | A2 | A3 | A4 | A5 | RX0 | TX1 | GND
bPlace: En | 13 | 12 | ~ | 9 | 6 | ~ | 5 | 21 | 20 | BAT | USB | 11~ | 10~ | SCL | SDA | CLOWNS?? IN OUTER SPACE\!? | HOLY SHIT | swclk | swdio | MOSI | MISO | RST | 3V | ARf | GND | A0 | A1 | A2 | A3 | A4 | A5 | SCK | 24 | 23 | 22 | RX | TX | GND | 0 | 1